# EAGLE schematic typical-circuit (EAGLE 7.5.0)
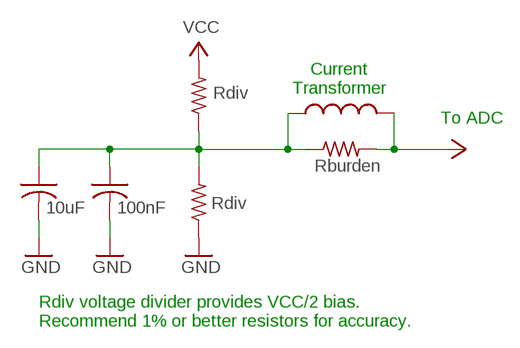
[diagram p0: schematic, sheet 1]

## Parts
C1  10uF  C-USM0805  [M0805]
C2  100nF  C-USM0805  [M0805]
L1  L-USTJ3-U2  [TJ3-U2]
R1  Rdiv  R-US_M0805  [M0805]
R2  Rdiv  R-US_M0805  [M0805]
R3  Rburden  R-US_M0805  [M0805]

## Nets
GND: C1.2 C2.2 R1.1
VCC: L1.2 R2.2 R3.2
VCC/2: C1.1 C2.1 L1.1 R1.2 R2.1 R3.1

## Notes on the sheet
- Current
  Transformer
- To ADC
- Rdiv voltage divider provides VCC/2 bias.
  Recommend 1% or better resistors for accuracy.

## Library data of the parts
C1 C2 = _jc:C-US: CAPACITOR, American symbol
L1 = rcl:L-US: INDUCTOR, American symbol
R1-R3 = _jc:R-US_: RESISTOR, American symbol